# Altium schematic sheet Power_Supply.SchDoc
size A4; DocumentNumber: 8; SheetNumber: 8; SheetTotal: 16
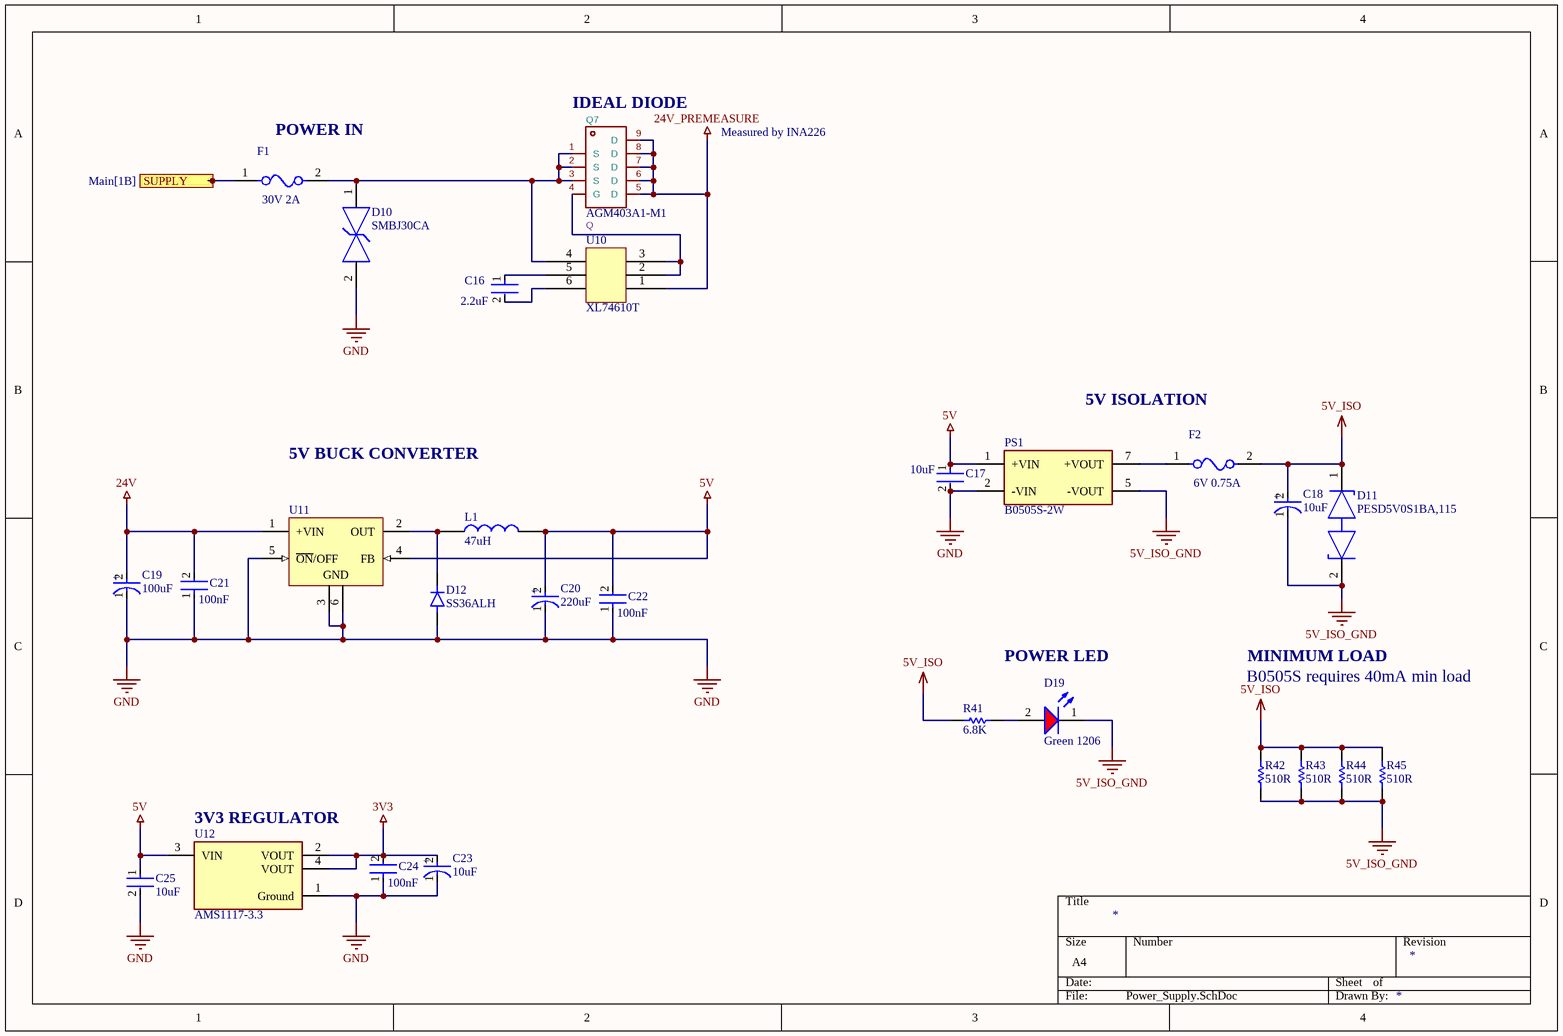
[diagram p0: Power_Supply.SchDoc]

## Parts
C16  2.2uF  [FP-GRM188-0_1-e0_2_0_5-MFG]
C17  10uF  [FP-C3216-160-0_2-IPC_A]
C18  10uF  [FP-FKB-MFG]
C19  100uF  [FP-FKF-MFG]
C20  220uF  [FP-FPF-MFG]
C21  100nF  [FP-1206-L_3_2_0_2-W_1_6_0-MFG]
C22  100nF  [FP-1206-L_3_2_0_2-W_1_6_0-MFG]
C23  10uF  [FP-FKB-MFG]
C24  100nF  [FP-1206-L_3_2_0_2-W_1_6_0-MFG]
C25  10uF  [FP-C3216-160-0_2-IPC_A]
D10  SMBJ30CA  [FP-SMBJ30CAHE3-52-MFG]
D11  PESD5V0S1BA,115  [FP-SOD323-CA-MFG]
D12  SS36ALH  [SODFL5226X100N]
D19  Green 1206  [WL-SMCW_1206_150120xx75000]
F1  30V 2A  [FP-MF-USMF-MFG]
F2  6V 0.75A  [FP-MF-USMF-MFG]
L1  47uH  [INDPM120120X800N]
PS1  B0505S-2W  [B0505S-2W]
Q7  AGM403A1-M1  Reference: Q  [DFN8_5X6MM]
R41  6.8K  [RESC1608X55X30LL15T15]
R42  510R  [RESC3216X70X50LL20T25]
R43  510R  [RESC3216X70X50LL20T25]
R44  510R  [RESC3216X70X50LL20T25]
R45  510R  [RESC3216X70X50LL20T25]
U10  XL74610T  [SOT95P245X110-6N]
U11  (no value)  [KTT0005B_L]
U12  AMS1117-3.3  [FP-AMS1117-IPC_C]

## Ports
SUPPLY (in, see Main[1B])

## Nets
3V3: C23.2(A) C24.2 U12.2(VOUT) U12.4(VOUT)
5V: C17.1 C20.2(A) C22.2 C25.1 L1.2 PS1.1(+VIN) U11.4(FB) U12.3(VIN)
5V_ISO: C18.2(A) D11.1(K1) F2.2 R41.1 R42.1 R43.1 R44.1 R45.1
5V_ISO_GND: C18.1(C) D11.2(K2) D19.1(K) PS1.5(-VOUT) R42.2 R43.2 R44.2 R45.2
24V: C19.2(A) C21.2 U11.1(+VIN)
24V_PREMEASURE: Q7.5(D) Q7.6(D) Q7.7(D) Q7.8(D) Q7.9(D) U10.1
GND: C17.2 C19.1(C) C20.1(C) C21.1 C22.1 C23.1(C) C24.1 C25.2 D10.2 D12.2(A) PS1.2(-VIN) U11.3(GND) U11.5(~{ON}/OFF) U11.6(GND) U12.1(Ground)
SUPPLY: F1.1 ; port SUPPLY
NetC16_1: C16.1 U10.5
NetC16_2: C16.2 U10.6
NetD10_1: D10.1 F1.2 Q7.1(S) Q7.2(S) Q7.3(S) U10.4
NetD12_1: D12.1(K) L1.1 U11.2(OUT)
NetD19_2: D19.2(A) R41.2
NetF2_1: F2.1 PS1.7(+VOUT)
NetQ7_4: Q7.4(G) U10.2 U10.3

## Notes on the sheet
- (near Q7) IDEAL DIODE
- (near F1) POWER IN
- Measured by INA226
- 5V ISOLATION
- 5V BUCK CONVERTER
- POWER LED
- B0505S requires 40mA min load
- MINIMUM LOAD
- (near U12) 3V3 REGULATOR
- (in symbol CMP-2000-06208-3) +
- (in symbol CMP-2000-06211-2) +
- (in symbol CMP-2000-06215-2) +

## Library data of the parts
C16 = CMP-2006-02836-2: Chip Multilayer Ceramic Capacitors for General Purpose, 0603, 2.2uF, X7R, 15%, 10%, 10V; Case Code (Metric): 1608; Height: 0.8mm; Packaging: Cut Tape; Voltage: 10V; Lead Free: Lead Free; Min Operating Temperature: -55°C; Voltage Rating (DC): 10V; Max Operating Temperature: 125°C; Voltage Rating: 10V; Dielectric: X7R; Depth: 0.8mm; Case Code (Imperial): 0603; Termination: SMD/SMT; Case/Package: 0603; Number of Pins: 2; REACH SVHC: No SVHC; Mount: Surface Mount; Width: 0.031inch; Material: Ceramic; Capacitance: 2.2uF; Package Quantity: 1; Weight: 7.1E-05oz; Length: 1.6mm; Thickness: 0.035inch; Tolerance: 10%
C17 C25 = CMP-2000-06045-2: Multilayer Ceramic Capacitors 10uF ±10% 50V X5R SMD 1206; Min Operating Temperature: -55°C; Weight: 0.000571oz; Tolerance: 10%; Lead Free: Lead Free; REACH SVHC: No SVHC; Dielectric Material: Ceramic; Termination: SMD/SMT; Radiation Hardening: No; Case Code (Metric): 3216; Max Operating Temperature: 85°C; Voltage Rating (DC): 50V; Packaging: Tape and Reel; Height: 1.6mm; Voltage: 50V; Dielectric: X5R; Mount: Surface Mount; Voltage Rating: 50V; Capacitance: 10uF; Length: 3.2mm; RoHS Compliant: Yes; Thickness: 0.071inch; Depth: 1.6mm; Width: 0.063inch; Case/Package: 1206; Series: C; Package Quantity: 1; Resistor Type: Ceramic; Case Code (Imperial): 1206; Construction: Flat
C18 C23 = CMP-2000-06211-2: CAP ALUM 10UF 20% 35V SMD; ESR (Equivalent Series Resistance): 1.35R; Ripple Current: 90mA; Leakage Current: 3uA; Polarity: Polar; Material: Aluminium; Life (Hours): 2000Hour; Height: 5.8mm; Voltage Rating: 35V; Max Operating Temperature: 105°C; Ripple Current (AC): 90mA; Voltage: 35V; Height - Seated (Max): 0.24inch; Lead Free: Lead Free; Contact Plating: Tin; Capacitance: 10uF; Series: FK; REACH SVHC: No SVHC; Construction: Cylindrical; Tolerance: 20%; Voltage Rating (DC): 35V; Number of Pins: 2; Packaging: Tape and Reel; RoHS Compliant: Yes; Min Operating Temperature: -55°C; Impedance: 1.35R; Package Quantity: 1; Termination: SMD/SMT; Length: 5.8mm; Case/Package: Radial; Diameter: 4mm; Radiation Hardening: No; Width: 5.5mm; Mount: Surface Mount
C19 = CMP-2000-06208-3: CAP ALUM 100UF 20% 50V SMD; Leakage Current: 3uA; ESR (Equivalent Series Resistance): 340mR; Material: Aluminium; Ripple Current: 350mA; Life (Hours): 2000Hour; Min Operating Temperature: -55°C; Contact Plating: Tin; REACH SVHC: No SVHC; RoHS Compliant: Yes; Width: 10mm; Radiation Hardening: No; Termination: SMD/SMT; Packaging: Tape and Reel; Max Operating Temperature: 105°C; Case/Package: Radial; Voltage Rating: 50V; Length: 10.2mm; Voltage: 50V; Package Quantity: 1; Voltage Rating (DC): 50V; Height - Seated (Max): 0.402inch; Mount: Surface Mount; Impedance: 340mR; Construction: Cylindrical; Height: 10.2mm; Lead Free: Lead Free; Dielectric Material: Aluminium; Series: FK; Tolerance: 20%; Diameter: 8mm; Ripple Current (AC): 350mA; Capacitance: 100uF; Number of Pins: 2
C20 = CMP-2000-06215-2: CAP ALUM 220UF 20% 35V SMD; Ripple Current (AC): 850mA; Life (Hours): 2000Hour; Polarity: Polar; ESR (Equivalent Series Resistance): 80mR; Material: Aluminium; Leakage Current: 77uA; RoHS Compliant: Yes; Number of Pins: 2; Length: 10.5mm; Height - Seated (Max): 0.402inch; Lead Pitch: 3.1mm; Construction: Cylindrical; Contact Plating: Tin; Tolerance: 20%; Voltage: 35V; REACH SVHC: No SVHC; Capacitance: 220uF; Width: 8.3mm; Max Operating Temperature: 105°C; Mount: Surface Mount; Package Quantity: 500; Min Operating Temperature: -55°C; Diameter: 8mm; Voltage Rating (DC): 35V; Packaging: Tape and Reel; Termination: SMD/SMT; Ripple Current: 850mA; Series: FP; Radiation Hardening: No; Case/Package: Radial; Voltage Rating: 35V; Height: 10.2mm; Lead Free: Lead Free
C21 C22 C24 = CMP-2000-05018-2: General Purpose Ceramic Capacitor, 1206, 100nF, 10%, X7R, 15%, 50V; Dissipation Factor: 2.5%; Insulation Resistance: 100GR; Dielectric: X7R; Thickness: 0.037inch; Case Code (Imperial): 1206; Case Code (Metric): 3216; Dielectric Material: Ceramic; Width: 1.6mm; Voltage Rating (DC): 50V; Termination: SMD/SMT; Tolerance: 10%; REACH SVHC: No SVHC; Height: 0.94mm; Length: 3.2mm; Voltage: 50V; Capacitance: 100nF; Packaging: Tape and Reel; Depth: 1.6mm; Voltage Rating: 50V; Series: -; Contact Plating: Tin; Mount: Surface Mount; Package Quantity: 1; Construction: Flat; Max Operating Temperature: 125°C; Min Operating Temperature: -55°C; Case/Package: 1206; Lead Free: Lead Free; RoHS Compliant: Yes; Number of Pins: 2; Radiation Hardening: No
D10 = CMP-02577-000018-1: TVS DIODE 30V 48.4V DO214AA; Manufacturer: Vishay Semiconductor Diodes Division; Manufacturer Part Number: SMBJ30CAHE3/52; Peak Pulse Power: 600W; Number Of Channels: 1; Automotive Grade: Grade 0; Peak Pulse Current: 12.4A; Standoff Height: 0mm; Max Junction Temp: +150°C; Breakdown Voltage: 33.3V; Direction: Bidirectional; Octopart: https://octopart.com/smbj30cahe3%2F52-vishay-43725255; Footprint Url: http://www.vishay.com/docs/95401/smb.pdf; Device Class L2: TVS Diodes; RoHS: TRUE; Automotive: Yes; Height: 2.44mm; Temperature: -55°C to +150°C; Category: Diode; ComponentLink2Description: Datasheet; Reverse Standoff Voltage: 30V; Device Class L3: unset; Package: DO-214AA; ComponentLink2URL: http://www.vishay.com/docs/88392/smbj.pdf; Temperature Range Low: -55°C; Mouser Description: Diode TVS Single Bi-Dir 30V 600W 2-Pin DO-214AA T/R; Temperature Range High: +150°C; Digikey Description: TVS DIODE 30V 48.4V DO214AA; Clamping Voltage: 48.4V; Lead Free: Yes; Device Class L1: Circuit Protection
D11 = CMP-14432-000001-1: TVS DIODE 5V 14V SOD323
D12 = SS36ALH: 3A, 60V, Schottky Rectifier; MF: Taiwan Semiconductor; MP: SS36ALH; Package: DO-221AC Taiwan Semiconductor; Price: None; Value: *; SnapEDA_Link: https://www.snapeda.com/parts/SS36ALH/Taiwan+Semiconductor/view-part/?ref=snap; Check_prices: https://www.snapeda.com/parts/SS36ALH/Taiwan+Semiconductor/view-part/?ref=eda; Availability: Not in stock
D19 = CMP-1426-00017-3: Led, Red, 630 Nm, 1.9 V, 30 Ma, 60 Mcd Rohs Compliant: Yes; Forward Current: 100mA; Max Reverse Voltage (DC): 5V; Lens Style: Clear, Rectangular; Viewing Angle: 140°; Luminous Intensity: 60mcd; Peak Wavelength: 645nm; Forward Voltage: 1.9V; Test Current: 20mA; Dominant Wavelength: 630nm; Case Code (Imperial): 1206; Length: 3.2mm; Mount: Surface Mount; Case Code (Metric): 3216; Case/Package: 1206; Min Operating Temperature: -40°C; Width: 1.6mm; Color: Red; Height: 680µm; REACH SVHC: Unknown; Max Operating Temperature: 85°C; Wavelength: 630nm; RoHS: Compliant; Packaging: Tape and Reel
F1 F2 = CMP-07400-000009-1: PTC RESET FUSE 30V 200MA 1210; Manufacturer: Bourns Inc.; Manufacturer Part Number: MF-USMF020-2; Current Rating: 10A; Resistance: 0.4-5Ω; Trip Time: 0.02s; Automotive Grade: Grade 3; Value: 0.4-5Ω; Hold Current: 0.2A; Trip Current: 0.4A; ComponentLink2URL: https://www.bourns.com/docs/Product-Datasheets/mfusmf.pdf; Category: Fuse; Temperature Range High: +85°C; Temperature: -40°C to +85°C; Device Class L3: unset; Device Class L2: PTC Resettable Fuses; Automotive: Yes; Height: 1.1mm; Package: MF-USMF; Device Class L1: Circuit Protection; Mouser Description: Resettable Fuses - PPTC 0.20A 30V 0.40ohm Hold .20A Trip .4A; ComponentLink2Description: Datasheet; Temperature Range Low: -40°C; RoHS: TRUE; Lead Free: Yes; Voltage Rating: 30V; Octopart: https://octopart.com/mf-usmf020-2-bourns-46429; Digikey Description: PTC RESET FUSE 30V 200MA 1210
L1 = SPD127R-473M: Fixed Inductors 47uH 20% .1ohm Shielded Choke SMT; Manufacturer_Name: API Delevan; Geometry.Height: 8mm; Mouser Part Number: 807-SPD127R-473M; Mouser Price/Stock: https://www.mouser.co.uk/ProductDetail/API-Delevan/SPD127R-473M?qs=Ri2cEtl8%2FQnrzzldCovvkw%3D%3D; Manufacturer_Part_Number: SPD127R-473M; Datasheet Link: https://componentsearchengine.com/Datasheets/1/SPD127R-473M.pdf
PS1 = 2S7BE_0505S3U: Isolated Module DC DC Converter 1 Output 5V 400mA 4.5V - 5.5V Input; MF: Gaptec; SnapEDA_Link: https://www.snapeda.com/parts/2S7BE_0505S3U/Gaptec/view-part/?ref=snap; Package: None; Value: *; MP: 2S7BE_0505S3U; Check_prices: https://www.snapeda.com/parts/2S7BE_0505S3U/Gaptec/view-part/?ref=eda
Q7 = AGM403A1-M1: Type:1 N-channel Drain to Source Voltage: Current - Continuous Drain(Id): RDS(on):2.2mΩ@10V,20A Pd - Power Dissipation(Pd): Gate Threshold Voltage (Vgs(th)@Id):1.2V Gate Charge(Qg):65nC@10V Input Capacitance(Ciss@Vds):5341pF@15V Reverse Transfer Capacitan; Manufacturer: AGM-Semi(芯控源); Footprint: ProLib_pcs_2025-06-23:DFN-8_L5.8-W4.9-P1.27-LS6.0-BL-1; Supplier: LCSC; Datasheet: https://atta.szlcsc.com/upload/public/pdf/source/20241030/BE071EF894F55F0B37AD6167FC56B3C6.pdf; Description_: Type:1 N-channel Drain to Source Voltage: Current - Continuous Drain(Id): RDS(on):2.2mΩ@10V,20A Pd - Power Dissipation(Pd): Gate Threshold Voltage (Vgs(th)@Id):1.2V Gate Charge(Qg):65nC@10V Input Capacitance(Ciss@Vds):5341pF@15V Reverse Transfer Capacitan; Manufacturer Part: AGM403A1-M1; Supplier Part: C42372665; LCSC Part Name: AGM403A1-M1
R41 = CMP-2000-00803-1: Part Number: ERJ-3GEYJ512V; Manufacturer: Panasonic
R42-R45 = CMP-2003-04407-1: Manufacturer: Panasonic; Part Number: ERA8AEB103V
U11 = CMP-2000-06545-1: Simple Switcher(R) Power Converter 150 kHz Step-Down Voltage Regulator, 3 A, 4.5 to 40 V, -40 to 125 degC, 5-Pin TO-263 (KTT), Green (RoHS & no Sb/Br), Tape and Reel; PartNumber: LM2596; Manufacturer: Texas Instruments; Package Version: 4200577-4/G, 01/2013; Primary Input Voltage: 40V; No. of Outputs: 1; No. of Pins: 5; SVHC: NoSVHC(19-Dec-2012); Output Voltage: 37V; Output Current: 3A; Datasheet Version: Rev. C, 04/2013; Package Reference: KTT5; MSL: MSL3-168hours; Number of Outputs: 1; Operating Temperature Min: -40°C; Operating Temperature Range: -40°Cto+125°C; Manufacturer URL: http://www.ti.com/; Package URL: http://www.ti.com/litv/pdf/mpsf007e; Voltage Regulator Case Style: TO-263; Operating Temperature Max: 125°C; Package Description: 5-Pin Plastic Flange Mount, Body 10.16 x 8.925 mm, Pitch 1.7 mm; Datasheet URL: http://www.ti.com/lit/ds/symlink/lm2596.pdf; Mounting Technology: SurfaceMount
U12 = CMP-209535-000001-1: LDO Voltage Regulators 1A, 3.3V; Manufacturer: Advanced Monolithic Systems; Dropout Voltage: 1.1V; Output Type: Fixed; Nominal Supply Current: 5mA; Max Power Dissipation: 1.2W; Max Supply Voltage: 15V; Number Of Outputs: 1; Standoff Height: 0.64mm; Max Junction Temp: +125°C; Height: 1.8mm; Package: AMS1117; Device Class L2: Power Management ICs; ComponentLink2Description: Datasheet; ComponentLink2URL: http://www.advanced-monolithic.com/pdf/ds1117.pdf; Category: IC; RoHS: TRUE; Automotive: No; Device Class L1: Integrated Circuits (ICs); Output Current: 1A; Device Class L3: Voltage Regulators - Linear; Temperature: -40°C to +125°C; Output Voltage: 3.3V; Manufacturer Part Number: AMS1117-3.3; Temperature Range Low: -40°C; Octopart: https://octopart.com/ams1117-3.3-advanced+monolithic+systems-25899300; Lead Free: Yes; Ipc Land Pattern Name: SOT229P700X180-4; Temperature Range High: +125°C